# Altium schematic sheet PUNO.SchDoc
size A4; SheetNumber: 1; SheetTotal: 1
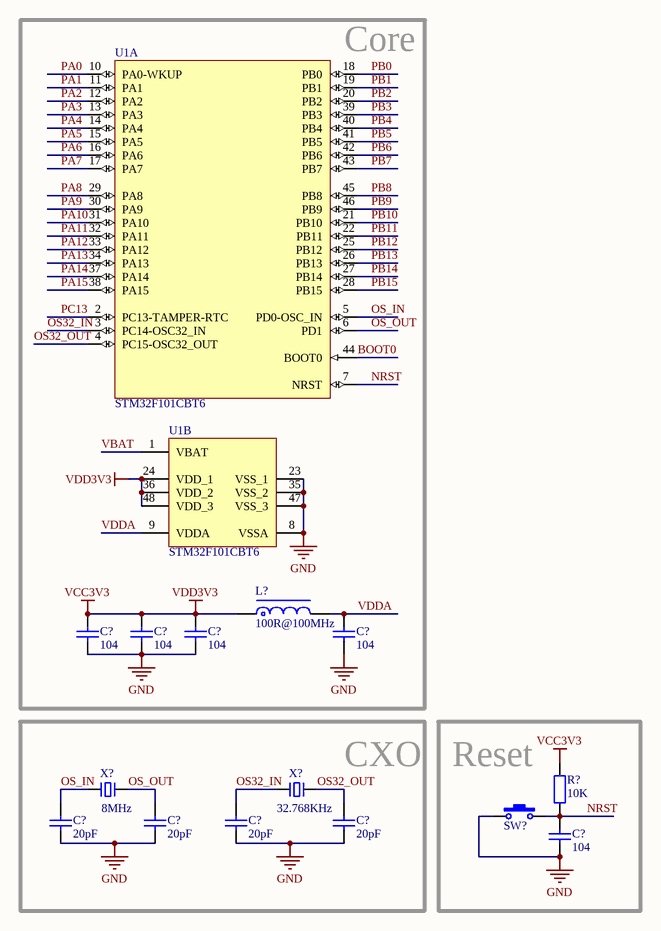
[diagram p0: PUNO.SchDoc]

## Parts
(Parts that share a designator on the sheet are numbered #1, #2 ... from top to bottom, then left to right.)
C?#1  104  [C0805_L]
C?#2  104  [C0805_L]
C?#3  104  [C0805_L]
C?#4  104  [C0805_L]
C?#5  20pF  [C0805_L]
C?#6  20pF  [C0805_L]
C?#7  20pF  [C0805_L]
C?#8  20pF  [C0805_L]
C?#9  104  [C0805_L]
L?  100R@100MHz  [FB3650_TH]
R?  10K  [R0805_L]
SW?  3x6x5  [SW SMD-3*6*2.5]  (value not drawn)
U1  STM32F101CBT6  [LQFP48_N]  (parts A,B of 2)
X?#1  8MHz  [HC-49S]
X?#2  32.768KHz  [HC-49S]

## Blocks framed on the sheet
Core: C?#1-C?#4 L? U1
CXO: C?#5-C?#8 X?#1 X?#2
Reset: C?#9 R? SW?

## Nets
GND: C?#1.1 C?#2.1 C?#3.1 C?#4.1 C?#5.1 C?#6.1 C?#7.1 C?#8.1 C?#9.1 SW?.1 U1.8(VSSA) U1.23(VSS_1) U1.35(VSS_2) U1.47(VSS_3)
VCC3V3: C?#1.2 C?#2.2 C?#3.2 L?.1 R?.2 U1.24(VDD_1) U1.36(VDD_2) U1.48(VDD_3)  [also labelled VDD3V3]
BOOT0: U1.44(BOOT0)
NRST: C?#9.2 R?.1 SW?.2 U1.7(NRST)
OS32_IN: C?#7.2 U1.3(PC14-OSC32_IN) X?#2.2
OS32_OUT: C?#8.2 U1.4(PC15-OSC32_OUT) X?#2.1
OS_IN: C?#5.2 U1.5(PD0-OSC_IN) X?#1.2
OS_OUT: C?#6.2 U1.6(PD1) X?#1.1
PA0: U1.10(PA0-WKUP)
PA1: U1.11(PA1)
PA2: U1.12(PA2)
PA3: U1.13(PA3)
PA4: U1.14(PA4)
PA5: U1.15(PA5)
PA6: U1.16(PA6)
PA7: U1.17(PA7)
PA8: U1.29(PA8)
PA9: U1.30(PA9)
PA10: U1.31(PA10)
PA11: U1.32(PA11)
PA12: U1.33(PA12)
PA13: U1.34(PA13)
PA14: U1.37(PA14)
PA15: U1.38(PA15)
PB0: U1.18(PB0)
PB1: U1.19(PB1)
PB2: U1.20(PB2)
PB3: U1.39(PB3)
PB4: U1.40(PB4)
PB5: U1.41(PB5)
PB6: U1.42(PB6)
PB7: U1.43(PB7)
PB8: U1.45(PB8)
PB9: U1.46(PB9)
PB10: U1.21(PB10)
PB11: U1.22(PB11)
PB12: U1.25(PB12)
PB13: U1.26(PB13)
PB14: U1.27(PB14)
PB15: U1.28(PB15)
PC13: U1.2(PC13-TAMPER-RTC)
VBAT: U1.1(VBAT)
VDDA: C?#4.2 L?.2 U1.9(VDDA)

## Library data of the parts
C?#1-C?#9 = C: 贴片电容; BOM名称: 无极性贴片电容; 联系卖家，免费查找封装: 唯一出售店铺网址https://shop463601444.taobao.com
L? = FB: 磁珠; BOM名称: 直插磁珠; 联系卖家，免费查找封装: 唯一出售店铺网址https://shop463601444.taobao.com
R? = R: 贴片电阻; 联系卖家，免费查找封装: 唯一出售店铺网址https://shop463601444.taobao.com; BOM名称: 贴片电阻
SW? = SW 3x6: 3x6轻触开关; 联系卖家，免费查找封装: 唯一出售店铺网址https://shop463601444.taobao.com; 封装库来自淘宝卖家ID：黄晶宝石: 其他店铺购入均为盗版假冒封装库，请立即申请退款; BOM名称: 3x6轻触开关
U1 = STM32F101CBT6: STM32 ARM-based 32-bit MCU Access Line with 128 kB Flash, 16 kB Internal RAM, -40 to +85癈 Temperature, 48-Pin LQFP, Tray; 联系卖家，免费查找封装: 唯一出售店铺网址https://shop463601444.taobao.com; DatasheetVersion: rev14.0, Apr-2011; PackageVersion: rev13, Apr-2011; PackageReference: LQFP48; PackageDescription: 48-Pin Low-Profile Quad Flat Pack, 7 x 7 mm Body, 0.5 mm Pitch (LQFP48); ComponentLink1Description: Manufacturer URL; ComponentLink1URL: http://www.st.com/; ComponentLink2Description: STM32F101 Datasheet; ComponentLink2URL: http://www.st.com/internet/com/TECHNICAL_RESOURCES/TECHNICAL_LITERATURE/DATASHEET/CD00161561.pdf; ComponentLink3Description: STM32 Family Web Page; ComponentLink3URL: www.st.com/stm32
X?#1 X?#2 = XTAL-2P: 2脚无源晶振(谐振器）; 联系卖家，免费查找封装: 唯一出售店铺网址https://shop463601444.taobao.com; BOM名称: 2脚无源晶振(谐振器）